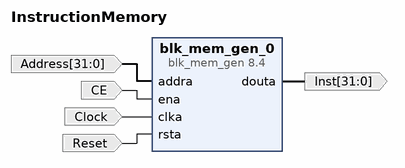
[diagram p0: block diagram of the top level]
# Vivado block design InstructionMemory, xc7a35ticsg324-1L, Vivado 2022.2
create_bd_design InstructionMemory

create_bd_port -dir I -from 31 -to 0 -type data Address
create_bd_port -dir I -type clk Clock
set_property -dict {CONFIG.FREQ_HZ 100000000} [get_bd_ports Clock]
create_bd_port -dir I -type ce CE
create_bd_port -dir I -type rst Reset
set_property -dict {CONFIG.POLARITY ACTIVE_HIGH} [get_bd_ports Reset]
create_bd_port -dir O -from 31 -to 0 -type data Inst

create_bd_cell -type ip -vlnv xilinx.com:ip:blk_mem_gen:8.4 blk_mem_gen_0
set_property -dict [list \
  CONFIG.Coe_File ../../../../../../memFile.coe \
  CONFIG.EN_SAFETY_CKT false \
  CONFIG.Load_Init_File true \
  CONFIG.Memory_Type Single_Port_ROM \
] [get_bd_cells blk_mem_gen_0]

# ---- connections ----

connect_bd_net [get_bd_ports Address] [get_bd_pins blk_mem_gen_0/addra]
connect_bd_net [get_bd_ports CE] [get_bd_pins blk_mem_gen_0/ena]
connect_bd_net [get_bd_ports Clock] [get_bd_pins blk_mem_gen_0/clka]
connect_bd_net [get_bd_ports Reset] [get_bd_pins blk_mem_gen_0/rsta]
connect_bd_net [get_bd_pins blk_mem_gen_0/douta] [get_bd_ports Inst]

validate_bd_design
save_bd_design
